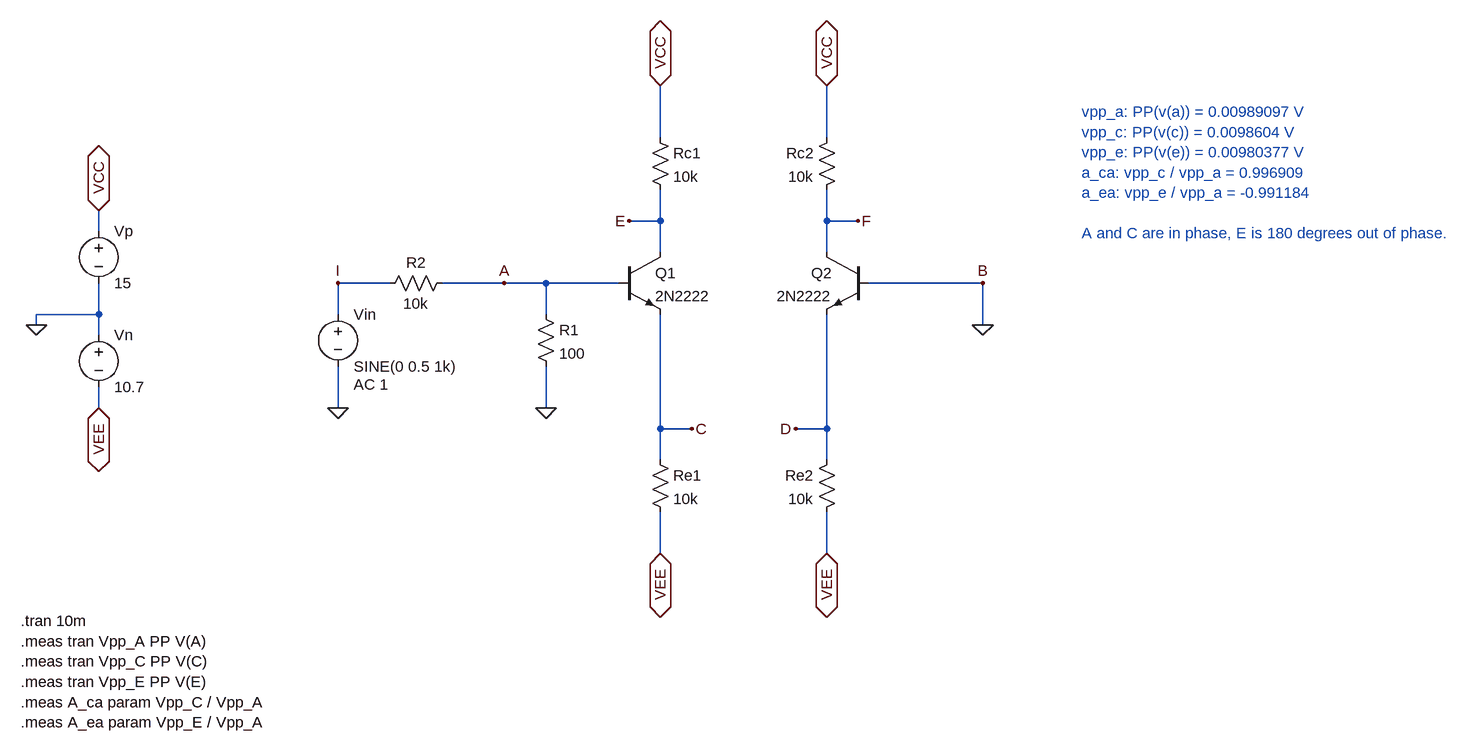
[diagram p0: schematic e1_2_a.asc]
e1_2_a.asc, the LTspice schematic file:
Version 4
SHEET 1 2164 900
WIRE 912 0 912 -80
WIRE 1168 0 1168 -80
WIRE 912 128 912 80
WIRE 912 128 864 128
WIRE 1168 128 1168 80
WIRE 1216 128 1168 128
WIRE 48 144 48 112
WIRE 912 176 912 128
WIRE 1168 176 1168 128
WIRE 496 224 416 224
WIRE 672 224 576 224
WIRE 736 224 672 224
WIRE 848 224 736 224
WIRE 1408 224 1232 224
WIRE 48 272 48 224
WIRE 48 272 -48 272
WIRE 416 272 416 224
WIRE 736 272 736 224
WIRE -48 288 -48 272
WIRE 1408 288 1408 224
WIRE 48 304 48 272
WIRE 48 416 48 384
WIRE 416 416 416 352
WIRE 736 416 736 352
WIRE 912 448 912 272
WIRE 960 448 912 448
WIRE 1168 448 1168 272
WIRE 1168 448 1120 448
WIRE 912 496 912 448
WIRE 1168 496 1168 448
WIRE 912 640 912 576
WIRE 1168 640 1168 576
FLAG -48 288 0
FLAG 48 112 VCC
IOPIN 48 112 BiDir
FLAG 48 416 VEE
IOPIN 48 416 BiDir
FLAG 736 416 0
FLAG 912 -80 VCC
IOPIN 912 -80 BiDir
FLAG 864 128 E
FLAG 672 224 A
FLAG 912 640 VEE
IOPIN 912 640 BiDir
FLAG 960 448 C
FLAG 1168 -80 VCC
IOPIN 1168 -80 BiDir
FLAG 1216 128 F
FLAG 1408 224 B
FLAG 1168 640 VEE
IOPIN 1168 640 BiDir
FLAG 1120 448 D
FLAG 1408 288 0
FLAG 416 416 0
FLAG 416 224 I
SYMBOL voltage 48 128 R0
SYMATTR InstName Vp
SYMATTR Value 15
SYMBOL voltage 48 288 R0
SYMATTR InstName Vn
SYMATTR Value 10.7
SYMBOL npn 848 176 R0
SYMATTR InstName Q1
SYMATTR Value 2N2222
SYMBOL res 896 -16 R0
SYMATTR InstName Rc1
SYMATTR Value 10k
SYMBOL res 720 256 R0
SYMATTR InstName R1
SYMATTR Value 100
SYMBOL res 896 480 R0
SYMATTR InstName Re1
SYMATTR Value 10k
SYMBOL npn 1232 176 M0
SYMATTR InstName Q2
SYMATTR Value 2N2222
SYMBOL res 1184 -16 M0
SYMATTR InstName Rc2
SYMATTR Value 10k
SYMBOL res 1184 480 M0
SYMATTR InstName Re2
SYMATTR Value 10k
SYMBOL voltage 416 256 R0
WINDOW 123 24 124 Left 2
WINDOW 39 0 0 Left 0
SYMATTR Value2 AC 1
SYMATTR InstName Vin
SYMATTR Value SINE(0 0.5 1k)
SYMBOL res 592 208 R90
WINDOW 0 0 56 VBottom 2
WINDOW 3 32 56 VTop 2
SYMATTR InstName R2
SYMATTR Value 10k
TEXT -72 744 Left 2 !.tran 10m\n.meas tran Vpp_A PP V(A)\n.meas tran Vpp_C PP V(C)\n.meas tran Vpp_E PP V(E)\n.meas A_ca param Vpp_C / Vpp_A\n.meas A_ea param Vpp_E / Vpp_A
TEXT 1560 -40 Left 2 ;vpp_a: PP(v(a)) = 0.00989097 V\nvpp_c: PP(v(c)) = 0.0098604 V\nvpp_e: PP(v(e)) = 0.00980377 V\na_ca: vpp_c / vpp_a = 0.996909\na_ea: vpp_e / vpp_a = -0.991184\n \nA and C are in phase, E is 180 degrees out of phase.

The netlist it stands for:
* e1_2_a.asc
Vp VCC 0 15
Vn 0 VEE 10.7
Q1 E A C 0 2N2222
Rc1 VCC E 10k
R1 A 0 100
Re1 C VEE 10k
Q2 F 0 D 0 2N2222
Rc2 VCC F 10k
Re2 D VEE 10k
Vin I 0 SINE(0 0.5 1k) AC 1
R2 A I 10k
.model NPN NPN
.model PNP PNP
.lib standard.bjt
.tran 10m
.meas tran Vpp_A PP V(A)
.meas tran Vpp_C PP V(C)
.meas tran Vpp_E PP V(E)
.meas A_ca param Vpp_C / Vpp_A
.meas A_ea param Vpp_E / Vpp_A
* vpp_a: PP(v(a)) = 0.00989097 V
* vpp_c: PP(v(c)) = 0.0098604 V
* vpp_e: PP(v(e)) = 0.00980377 V
* a_ca: vpp_c / vpp_a = 0.996909
* a_ea: vpp_e / vpp_a = -0.991184
* A and C are in phase, E is 180 degrees out of phase.
.backanno
.end